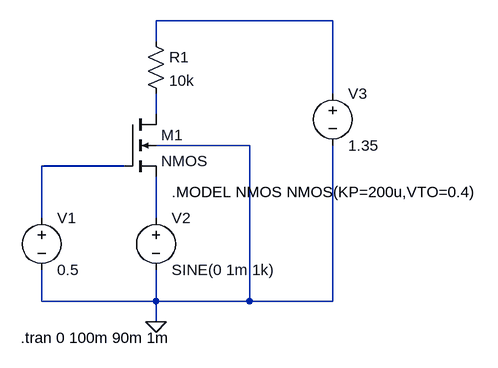
[diagram p0: schematic CG Amplifier_NMOS.asc]
CG Amplifier_NMOS.asc, the LTspice schematic file:
Version 4
SHEET 1 880 680
WIRE 416 -48 144 -48
WIRE 144 -16 144 -48
WIRE 416 64 416 -48
WIRE 144 96 144 64
WIRE 288 144 144 144
WIRE 96 176 -32 176
WIRE -32 256 -32 176
WIRE 144 256 144 192
WIRE -32 384 -32 336
WIRE 144 384 144 336
WIRE 144 384 -32 384
WIRE 288 384 288 144
WIRE 288 384 144 384
WIRE 416 384 416 144
WIRE 416 384 288 384
WIRE 144 416 144 384
FLAG 144 416 0
SYMBOL res 128 -32 R0
SYMATTR InstName R1
SYMATTR Value 10k
SYMBOL voltage -32 240 R0
WINDOW 123 0 0 Left 0
WINDOW 39 0 0 Left 0
SYMATTR InstName V1
SYMATTR Value 0.5
SYMBOL voltage 144 240 R0
WINDOW 123 0 0 Left 0
WINDOW 39 0 0 Left 0
SYMATTR InstName V2
SYMATTR Value SINE(0 1m 1k)
SYMBOL voltage 416 48 R0
SYMATTR InstName V3
SYMATTR Value 1.35
SYMBOL nmos4 96 96 R0
SYMATTR InstName M1
SYMATTR Value2 l=1u w=80u
TEXT -64 440 Left 2 !.tran 0 100m 90m 1m
TEXT 168 216 Left 2 !.MODEL NMOS NMOS(KP=200u,VTO=0.4)

The netlist it stands for:
* CG Amplifier_NMOS.asc
R1 N001 N002 10k
V1 N003 0 0.5
V2 N004 0 SINE(0 1m 1k)
V3 N001 0 1.35
M1 N002 N003 N004 0 NMOS l=1u w=80u
.model NMOS NMOS
.model PMOS PMOS
.lib standard.mos
.tran 0 100m 90m 1m
.MODEL NMOS NMOS(KP=200u,VTO=0.4)
.backanno
.end